# Altium schematic sheet Teensy.SchDoc
size A4
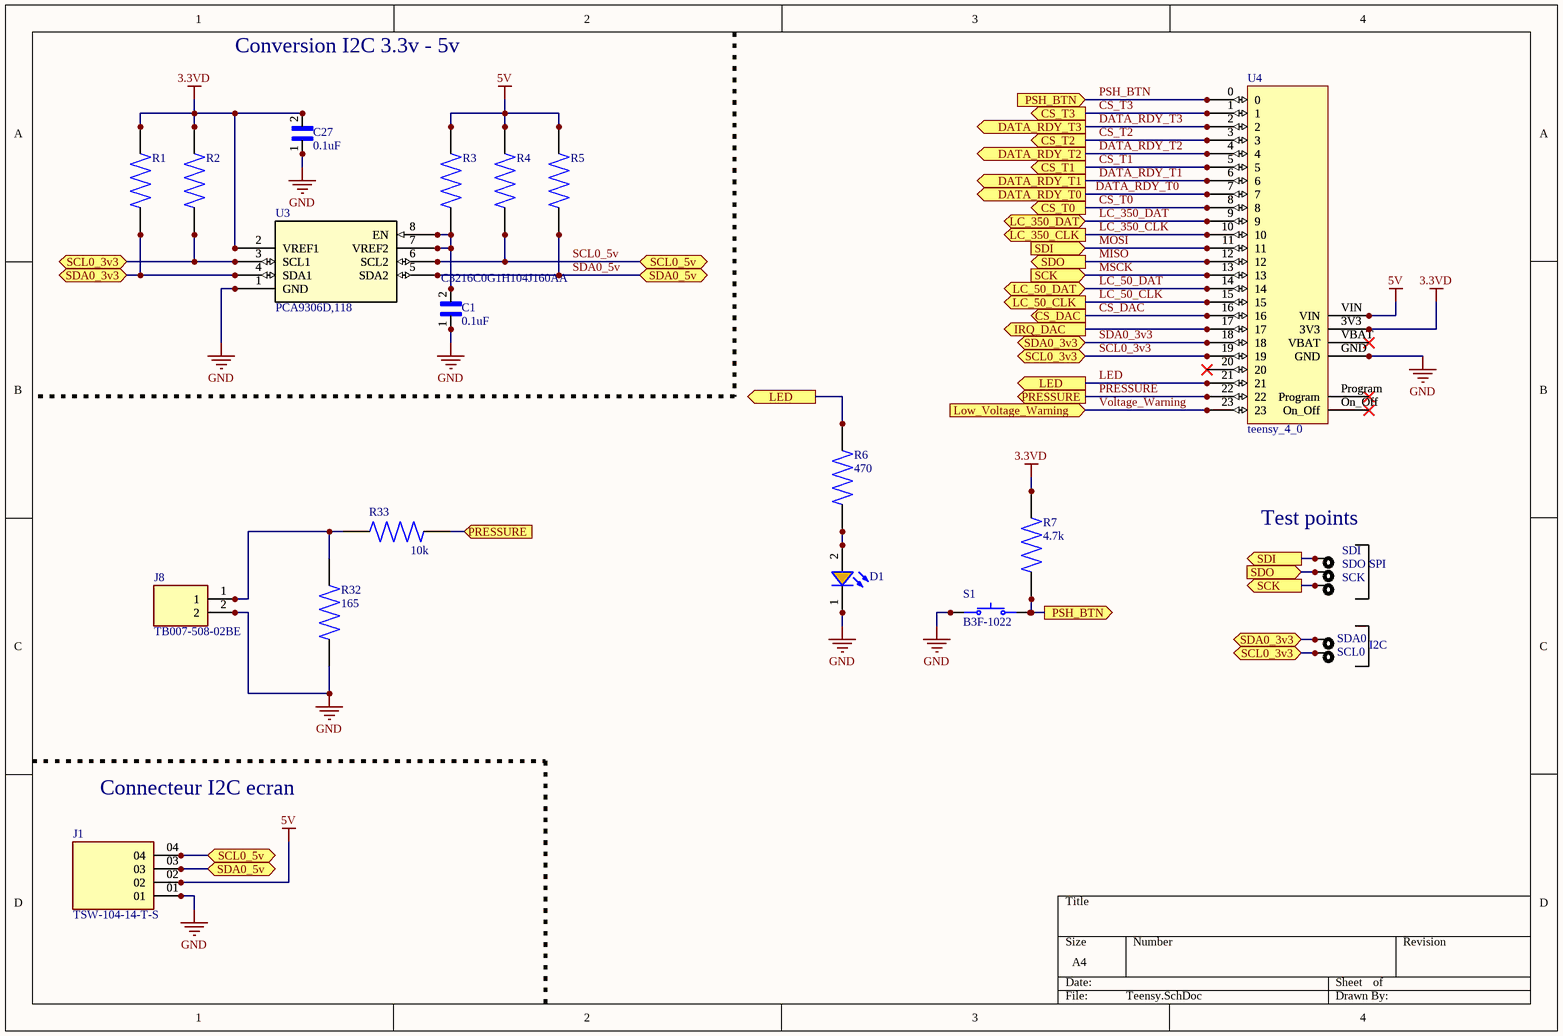
[diagram p0: Teensy.SchDoc]

## Parts
C1  C3216C0G1H104J160AA  value 0.1uF  [C3216C0G1H104J160AA]
C27  value 0.1uF  [C3216C0G1H104J160AA]  (hidden comment: C3216C0G1H104J160AA)
D1  150120YS75000  [150120YS75000]  (value not drawn)
J1  TSW-104-14-T-S  [TSW-104-14-T-S]
J8  TB007-508-02BE  [CUI_TB007-508-02BE]
R1  ESR10EZPJ222  [RESC2012X65N]  (value not drawn)
R2  ESR10EZPJ222  [RESC2012X65N]  (value not drawn)
R3  ERJ-6GEYJ204V  [RESC2012X70N]  (value not drawn)
R4  ESR10EZPJ222  [RESC2012X65N]  (value not drawn)
R5  ESR10EZPJ222  [RESC2012X65N]  (value not drawn)
R6  value 470  [RMCF1206JT470R]  (hidden comment: RMCF1206JT470R)
R7  value 4.7k  [CRGH0805F4K7]  (hidden comment: CRGH0805F4K7)
R32  value 165  [RC1206FR-07165RL]  (hidden comment: RC1206FR-07165RL)
R33  value 10k  [ERJ-P06J103V]  (hidden comment: ERJ-P06J103V)
S1  B3F-1022  [B3F-1022]
SCK  RCS-0C  [RCS-0C]  (value not drawn)
SCL0  RCS-0C  [RCS-0C]  (value not drawn)
SDA0  RCS-0C  [RCS-0C]  (value not drawn)
SDI  RCS-0C  [RCS-0C]  (value not drawn)
SDO  RCS-0C  [RCS-0C]  (value not drawn)
U3  PCA9306D,118  [SO8_SOT96-1_NXP]
U4  teensy_4_0  [teensy_4_0]

## Ports
CS_DAC (out), CS_T0 (out), CS_T1 (out), CS_T2 (out), CS_T3 (out), DATA_RDY_T0 (out), DATA_RDY_T1 (out), DATA_RDY_T2 (out), DATA_RDY_T3 (out), IRQ_DAC (out), LC_50_CLK (out), LC_50_DAT (bidir), LC_350_CLK (out), LC_350_DAT (bidir), LED (out), Low_Voltage_Warning (in), PRESSURE (in), PRESSURE (out), PSH_BTN (in), PSH_BTN (out), SCK (in), SCK (out), SCL0_3v3 (bidir), SCL0_5v (bidir), SDA0_3v3 (bidir), SDA0_5v (bidir), SDI (in), SDI (out), SDO (in), SDO (out)

## Nets
3.3VD: C27.2 R1.2 R2.2 R7.2 U3.2(VREF1) U4.3V3
5V: J1.02 R3.2 R4.2 R5.2 U4.VIN
GND: C1.1 C27.1 D1.1(K) J1.01 J8.2 R32.1 S1.1(COM) U3.1(GND) U4.GND
CS_DAC: U4.16 ; port CS_DAC
CS_T0: U4.8 ; port CS_T0
CS_T1: U4.5 ; port CS_T1
CS_T2: U4.3 ; port CS_T2
CS_T3: U4.1 ; port CS_T3
DATA_RDY_T0: U4.7 ; port DATA_RDY_T0
DATA_RDY_T1: U4.6 ; port DATA_RDY_T1
DATA_RDY_T2: U4.4 ; port DATA_RDY_T2
DATA_RDY_T3: U4.2 ; port DATA_RDY_T3
IRQ_DAC: U4.17 ; port IRQ_DAC
LC_50_CLK: U4.15 ; port LC_50_CLK
LC_50_DAT: U4.14 ; port LC_50_DAT
LC_350_CLK: U4.10 ; port LC_350_CLK
LC_350_DAT: U4.9 ; port LC_350_DAT
LED: R6.2 U4.21 ; port LED
MISO: SDO.1 U4.12 ; port SDO
MOSI: SDI.1 U4.11 ; port SDI
MSCK: SCK.1 U4.13 ; port SCK
PRESSURE: R33.2 U4.22 ; port PRESSURE
PSH_BTN: R7.1 S1.3(NO) U4.0 ; port PSH_BTN
SCL0_3v3: R2.1 SCL0.1 U3.3(SCL1) U4.19 ; port SCL0_3v3
SCL0_5v: J1.04 R4.1 U3.6(SCL2) ; port SCL0_5v
SDA0_3v3: R1.1 SDA0.1 U3.4(SDA1) U4.18 ; port SDA0_3v3
SDA0_5v: J1.03 R5.1 U3.5(SDA2) ; port SDA0_5v
Voltage_Warning: U4.23 ; port Low_Voltage_Warning
NetC1_2: C1.2 R3.1 U3.7(VREF2) U3.8(EN)
NetD1_2: D1.2(A) R6.1
NetJ8_1: J8.1 R32.2 R33.1

Not connected (* = marked no-connect by the designer): U4 20* On_Off* Program* VBAT*

## Notes on the sheet
- Conversion I2C 3.3v - 5v
- Test points
- SPI
- I2C
- Connecteur I2C ecran

## Library data of the parts
D1 = 150120YS75000: Yellow 590nm LED Indication - Discrete 2V 1206 (3216 Metric)
J8 = TB007-508-02BE: 2~24 Poles, Screw Type, Horizontal, 5.08 Pitch, 24~12 _AWG_, Terminal Block Connector; MF: CUI Devices; SnapEDA_Link: https://www.snapeda.com/parts/TB007-508-02BE/CUI%20Devices/view-part/3591212/?ref=snap; Value: *; Availability: Unavailable; MP: TB007-508-02BE; Price: None; Package: None
R1 R2 R4 R5 = ESR10EZPJ222: 2.2 kOhms Â±5% 0.4W, 2/5W Chip Resistor 0805 (2012 Metric) Automotive AEC-Q200, Pulse Withstanding Thick Film; MF: Rohm; MP: ESR10EZPJ222; Value: *; Purchase-URL: https://pricing.snapeda.com/search/part/ESR10EZPJ222/?ref=eda; Package: 2012 Rohm Semiconductor; Check_prices: https://www.snapeda.com/parts/ESR10EZPJ222/Rohm/view-part/977759/?ref=eda; Digi-Key_Part_Number: RHM2.2KKCT-ND; SnapEDA_Link: https://www.snapeda.com/parts/ESR10EZPJ222/Rohm/view-part/977759/?ref=snap
R3 = ERJ-6GEYJ204V: Resistor;Thick Film;Res 200 Kilohms;Pwr-Rtg 0.125 W;Tol 5%;SMT;0805;Tape & Reel; Package: None; Price: None; Value: *; MP: ERJ-6GEYJ204V; Availability: Unavailable
R6 = RMCF1206JT470R: RES 470 OHM 5% 1/4W 1206
R7 = CRGH0805F4K7: CRGH0805 1% 4K7 0.33W; Tolerance: ±1%
R32 = RC1206FR-07165RL: 165 Ohms ±1% 0.25W, 1/4W Chip Resistor 1206 (3216 Metric) Moisture Resistant Thick Film; Tolerance: ±1%
R33 = ERJ-P06J103V: RES SMD 10K OHM 5% 1/2W 0805; Tolerance: ±5%
S1 = B3F-1022: SWITCH TACTILE SPST-NO 0.05A 24V; pin to pad: 1>1+2 3>3+4
SCK SCL0 SDA0 SDI SDO = RCS-0C: PC TEST POINT NATURAL
U3 = PCA9306D,118: No Description Available; Vendor: NXP; Built_By: EMA_Cory; SourceLibrary: Add_to_database_2021-01-28; Datasheet: https://www.nxp.com/docs/en/data-sheet/PCA9306.pdf; Manufacturer_Part_Number: PCA9306D,118; Copyright: Copyright (C) 2018 Accelerated Designs. All rights reserved; RefDes: RefDes; Type: DEV